# Altium schematic sheet Controller.SchDoc: Set in Document Options » Parameters » Title
size Tabloid; Author: Set in Document Options » Parameters » Author + Contact info
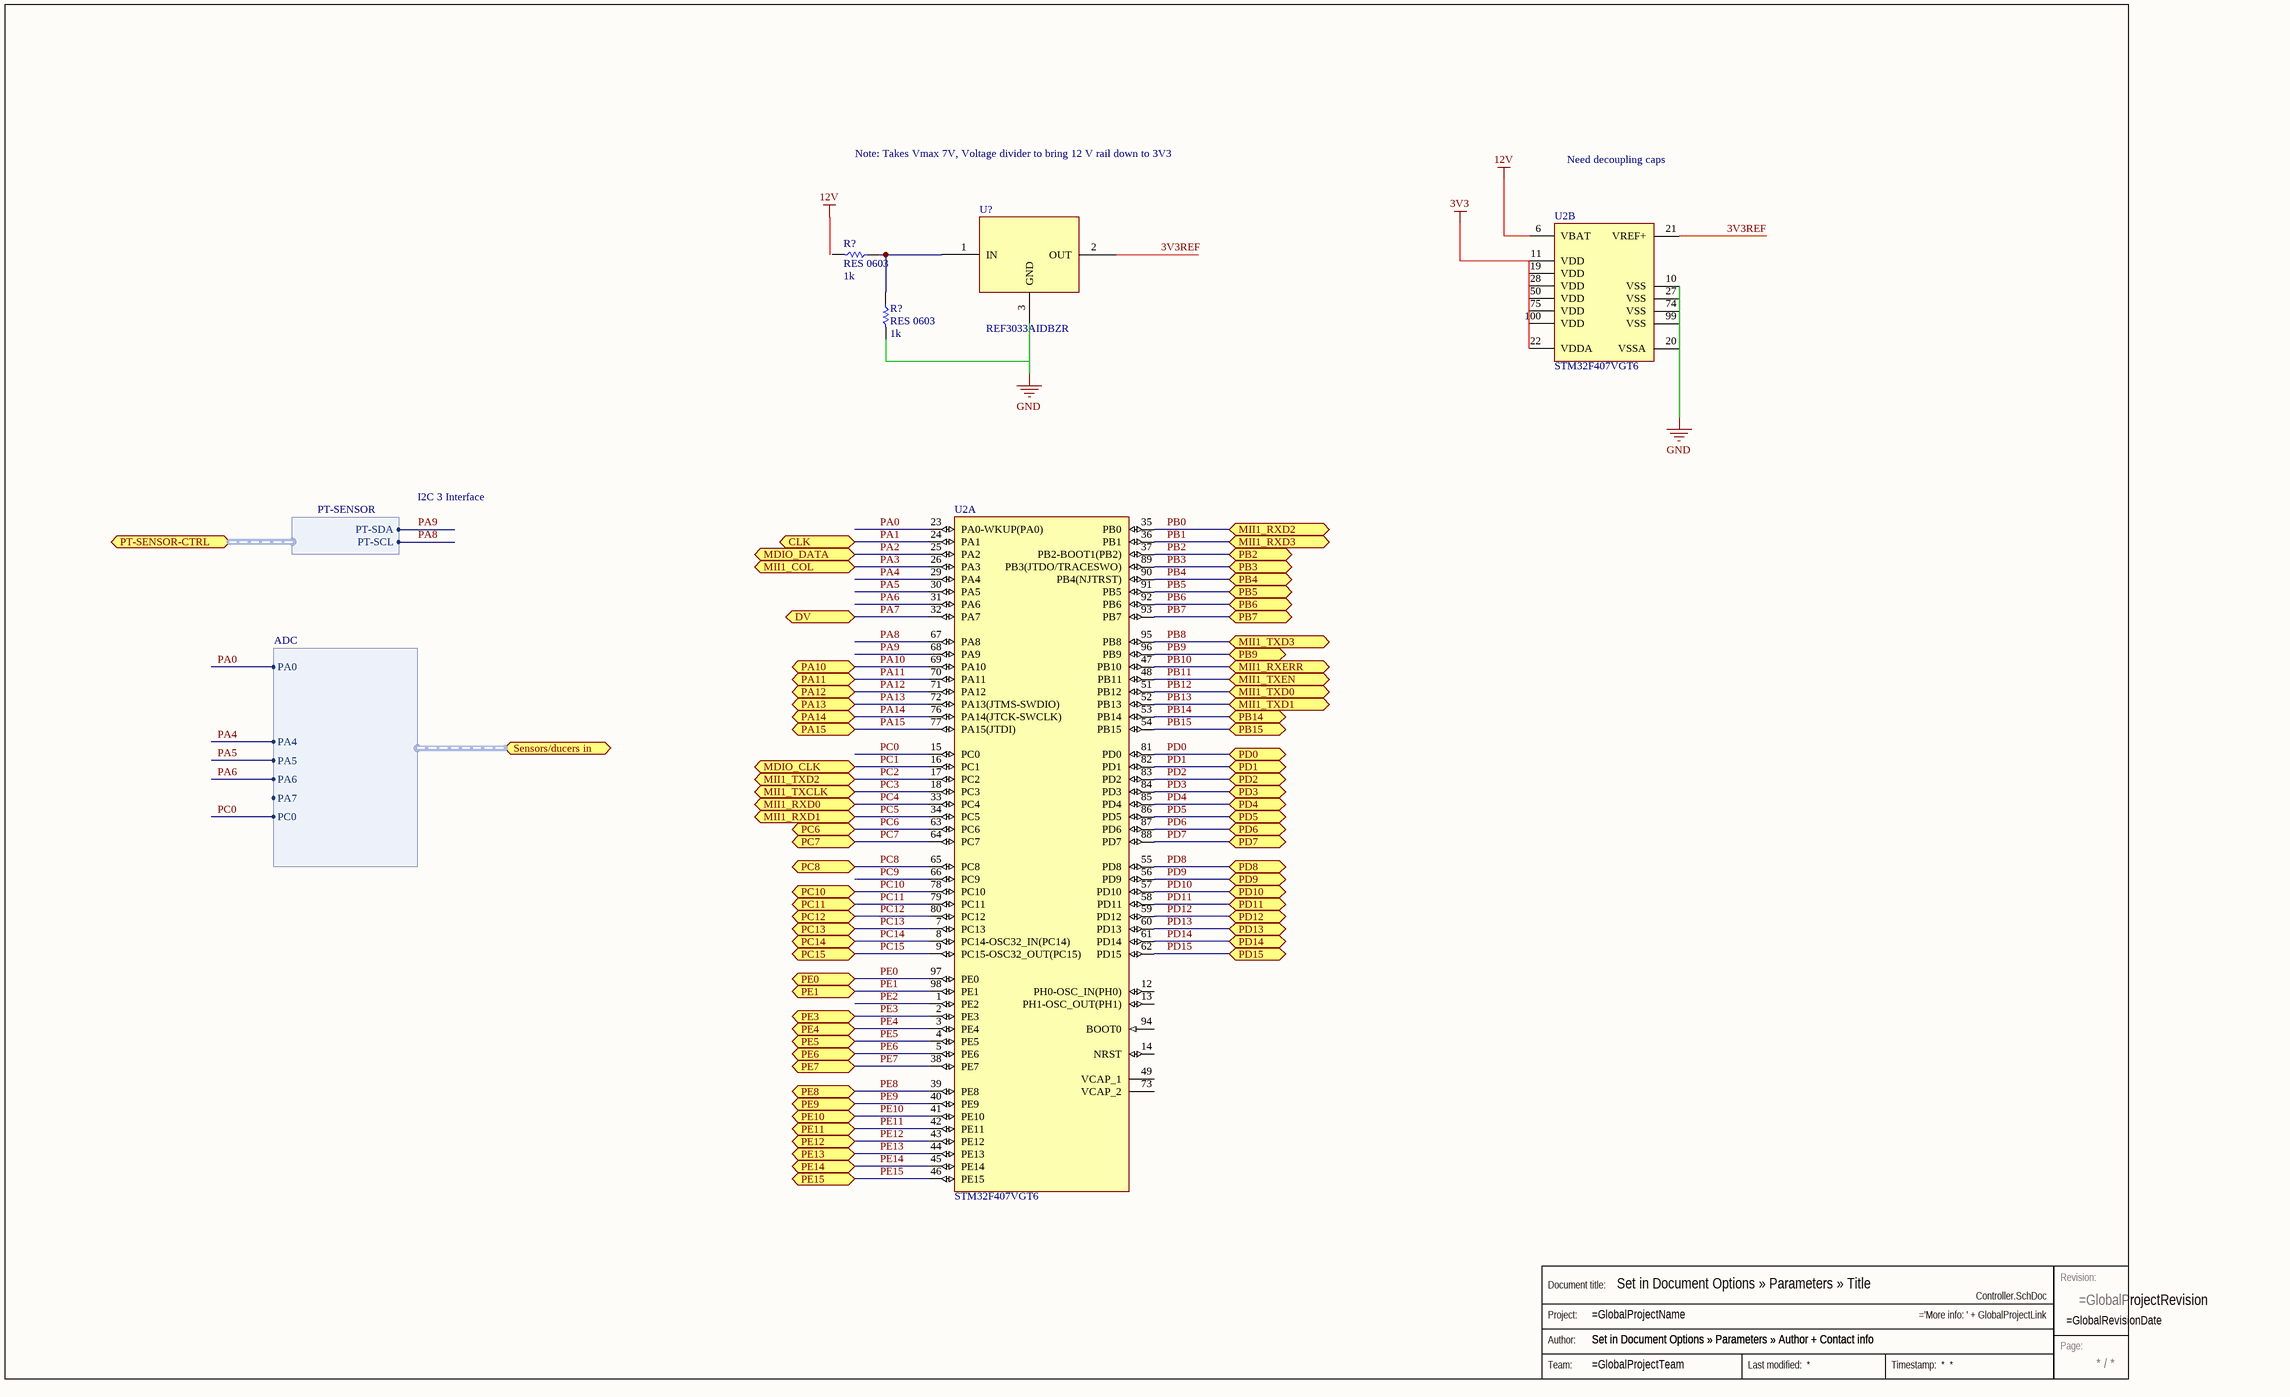
[diagram p0: Controller.SchDoc]

## Parts
(Parts that share a designator on the sheet are numbered #1, #2 ... from top to bottom, then left to right.)
R?#1  RES 0603  Value (Ohms): 1k  [RES 0603]
R?#2  RES 0603  Value (Ohms): 1k  [RES 0603]
Stamp  Stamp  (value not drawn)  (graphical)
U2  STM32F407VGT6  [STM-LQFP100_N]  (parts A,B of 2)
U?  REF3033AIDBZR  [SOT95P282X145-3N]

## Ports
CLK, DV, MDIO_CLK, MDIO_DATA, MII1_COL, MII1_RXD0, MII1_RXD1, MII1_RXD2, MII1_RXD3, MII1_RXERR, MII1_TXCLK, MII1_TXD0, MII1_TXD1, MII1_TXD2, MII1_TXD3, MII1_TXEN, PA10, PA11, PA12, PA13, PA14, PA15, PB2, PB3, PB4, PB5, PB6, PB7, PB9, PB14, PB15, PC6, PC7, PC8, PC10, PC11, PC12, PC13, PC14, PC15, PD0, PD1, PD2, PD3, PD4, PD5, PD6, PD7, PD8, PD9, PD10, PD11, PD12, PD13, PD14, PD15, PE0, PE1, PE3, PE4, PE5, PE6, PE7, PE8, PE9, PE10, PE11, PE12, PE13, PE14, PE15, PT-SENSOR-CTRL (harness PT-SENSOR), Sensors/ducers in (harness ADC)

## Harnesses
PT-SENSOR: PT-SCL, PT-SDA
ADC: PA0, PA4, PA5, PA6, PA7, PC0

## Nets
PA0: U2.23(PA0-WKUP(PA0)) ; port Sensors/ducers in.PA0
PA1: U2.24(PA1) ; port CLK
PA2: U2.25(PA2) ; port MDIO_DATA
PA3: U2.26(PA3) ; port MII1_COL
PA4: U2.29(PA4) ; port Sensors/ducers in.PA4
PA5: U2.30(PA5) ; port Sensors/ducers in.PA5
PA6: U2.31(PA6) ; port Sensors/ducers in.PA6
PA7: U2.32(PA7) ; port DV
PA8: U2.67(PA8) ; port PT-SENSOR-CTRL.PT-SCL
PA9: U2.68(PA9) ; port PT-SENSOR-CTRL.PT-SDA
PA10: U2.69(PA10) ; port PA10
PA11: U2.70(PA11) ; port PA11
PA12: U2.71(PA12) ; port PA12
PA13: U2.72(PA13(JTMS-SWDIO)) ; port PA13
PA14: U2.76(PA14(JTCK-SWCLK)) ; port PA14
PA15: U2.77(PA15(JTDI)) ; port PA15
PB0: U2.35(PB0) ; port MII1_RXD2
PB1: U2.36(PB1) ; port MII1_RXD3
PB2: U2.37(PB2-BOOT1(PB2)) ; port PB2
PB3: U2.89(PB3(JTDO/TRACESWO)) ; port PB3
PB4: U2.90(PB4(NJTRST)) ; port PB4
PB5: U2.91(PB5) ; port PB5
PB6: U2.92(PB6) ; port PB6
PB7: U2.93(PB7) ; port PB7
PB8: U2.95(PB8) ; port MII1_TXD3
PB9: U2.96(PB9) ; port PB9
PB10: U2.47(PB10) ; port MII1_RXERR
PB11: U2.48(PB11) ; port MII1_TXEN
PB12: U2.51(PB12) ; port MII1_TXD0
PB13: U2.52(PB13) ; port MII1_TXD1
PB14: U2.53(PB14) ; port PB14
PB15: U2.54(PB15) ; port PB15
PC0: U2.15(PC0) ; port Sensors/ducers in.PC0
PC1: U2.16(PC1) ; port MDIO_CLK
PC2: U2.17(PC2) ; port MII1_TXD2
PC3: U2.18(PC3) ; port MII1_TXCLK
PC4: U2.33(PC4) ; port MII1_RXD0
PC5: U2.34(PC5) ; port MII1_RXD1
PC6: U2.63(PC6) ; port PC6
PC7: U2.64(PC7) ; port PC7
PC8: U2.65(PC8) ; port PC8
PC9: U2.66(PC9)
PC10: U2.78(PC10) ; port PC10
PC11: U2.79(PC11) ; port PC11
PC12: U2.80(PC12) ; port PC12
PC13: U2.7(PC13) ; port PC13
PC14: U2.8(PC14-OSC32_IN(PC14)) ; port PC14
PC15: U2.9(PC15-OSC32_OUT(PC15)) ; port PC15
PD0: U2.81(PD0) ; port PD0
PD1: U2.82(PD1) ; port PD1
PD2: U2.83(PD2) ; port PD2
PD3: U2.84(PD3) ; port PD3
PD4: U2.85(PD4) ; port PD4
PD5: U2.86(PD5) ; port PD5
PD6: U2.87(PD6) ; port PD6
PD7: U2.88(PD7) ; port PD7
PD8: U2.55(PD8) ; port PD8
PD9: U2.56(PD9) ; port PD9
PD10: U2.57(PD10) ; port PD10
PD11: U2.58(PD11) ; port PD11
PD12: U2.59(PD12) ; port PD12
PD13: U2.60(PD13) ; port PD13
PD14: U2.61(PD14) ; port PD14
PD15: U2.62(PD15) ; port PD15
PE0: U2.97(PE0) ; port PE0
PE1: U2.98(PE1) ; port PE1
PE2: U2.1(PE2)
PE3: U2.2(PE3) ; port PE3
PE4: U2.3(PE4) ; port PE4
PE5: U2.4(PE5) ; port PE5
PE6: U2.5(PE6) ; port PE6
PE7: U2.38(PE7) ; port PE7
PE8: U2.39(PE8) ; port PE8
PE9: U2.40(PE9) ; port PE9
PE10: U2.41(PE10) ; port PE10
PE11: U2.42(PE11) ; port PE11
PE12: U2.43(PE12) ; port PE12
PE13: U2.44(PE13) ; port PE13
PE14: U2.45(PE14) ; port PE14
PE15: U2.46(PE15) ; port PE15
NetR?#1_2: R?#1.2 R?#2.2 U?.1(IN)

Not connected (* = marked no-connect by the designer): R?#1 1; R?#2 1; U2 6(VBAT) 10(VSS) 11(VDD) 12(PH0-OSC_IN(PH0)) 13(PH1-OSC_OUT(PH1)) 14(NRST) 19(VDD) 20(VSSA) 21(VREF+) 22(VDDA) 27(VSS) 28(VDD) 49(VCAP_1) 50(VDD) 73(VCAP_2) 74(VSS) 75(VDD) 94(BOOT0) 99(VSS) 100(VDD); U? 2(OUT) 3(GND)

## Buses and harness runs
bus 3V3REF

## Notes on the sheet
- Note: Takes Vmax 7V, Voltage divider to bring 12 V rail down to 3V3
- Need decoupling caps
- I2C 3 Interface
- Labels drawn without touching a wire or pin: 3V3, 12V, GND
- (in symbol Stamp) Revision:; Document title:; Project:; Author:; Page:; Team:

## Library data of the parts
U2 = STM32F407VGT6: ARM Cortex-M4 32-bit MCU+FPU, 210 DMIPS, 1024 kB Flash, 192 kB Internal RAM, 82 I/Os, 100-pin LQFP, -40 to 85 degC, Tray; Manufacturer: STMicroelectronics; D/A Converter: 2x12-bit; FLASH Size (Prog) (kB): 1024; I/Os (High Current): 82; Internal RAM Size (kB): 192; Operating Frequency(F) (Processor speed) (MHz): 168; Supply Voltage(Vcc) max (V): 3.6; Supply Voltage(Vcc) min (V): 1.8; DatasheetVersion: Rev. 4; PackageVersion: Rev. 1, 06/2013; PackageReference: LQFP100; PackageDescription: 100-Pin Low Profile Quad Flat Package, 14 x 14 mm Body, 0.5 mm Pitch; Supplier 1: Digi-Key; Supplier Part Number 1: 497-11605-ND; Supplier 2: Farnell; Supplier Part Number 2: 2064368; Supplier 3: Newark; Supplier Part Number 3: 73T2333; Supplier 4: Mouser; Supplier Part Number 4: 511-STM32F407VGT6; Core: ARM Cortex-M4; Packing: Tray; Mounting Technology: Surface Mount; PartNumber: STM32F407VGT6; ComponentLink1Description: Manufacturer URL; ComponentLink1URL: http://www.st.com/web/en/home.html; ComponentLink2Description: Datasheet; ComponentLink2URL: http://www.st.com/st-web-ui/static/active/en/resource/technical/document/datasheet/DM00037051.pdf; ComponentLink3Description: Package Specification; ComponentLink3URL: http://www.st.com/st-web-ui/static/active/en/resource/technical/document/data_brief/DM00071938.pdf
U? = REF3033AIDBZR: Manufacturer: Texas Instrument; Digikey Link: https://www.digikey.com/product-detail/en/texas-instruments/REF3033AIDBZR/296-26324-1-ND/2254967; Digikey P/N: 296-26324-1-ND; Manufacturer P/N: REF3033AIDBZR
R?#1 R?#2 = RES 0603: PartNumber: *; Tolerance: *